# Altium schematic sheet CH32X035C-R0.SchDoc
size 304 x 254 mm
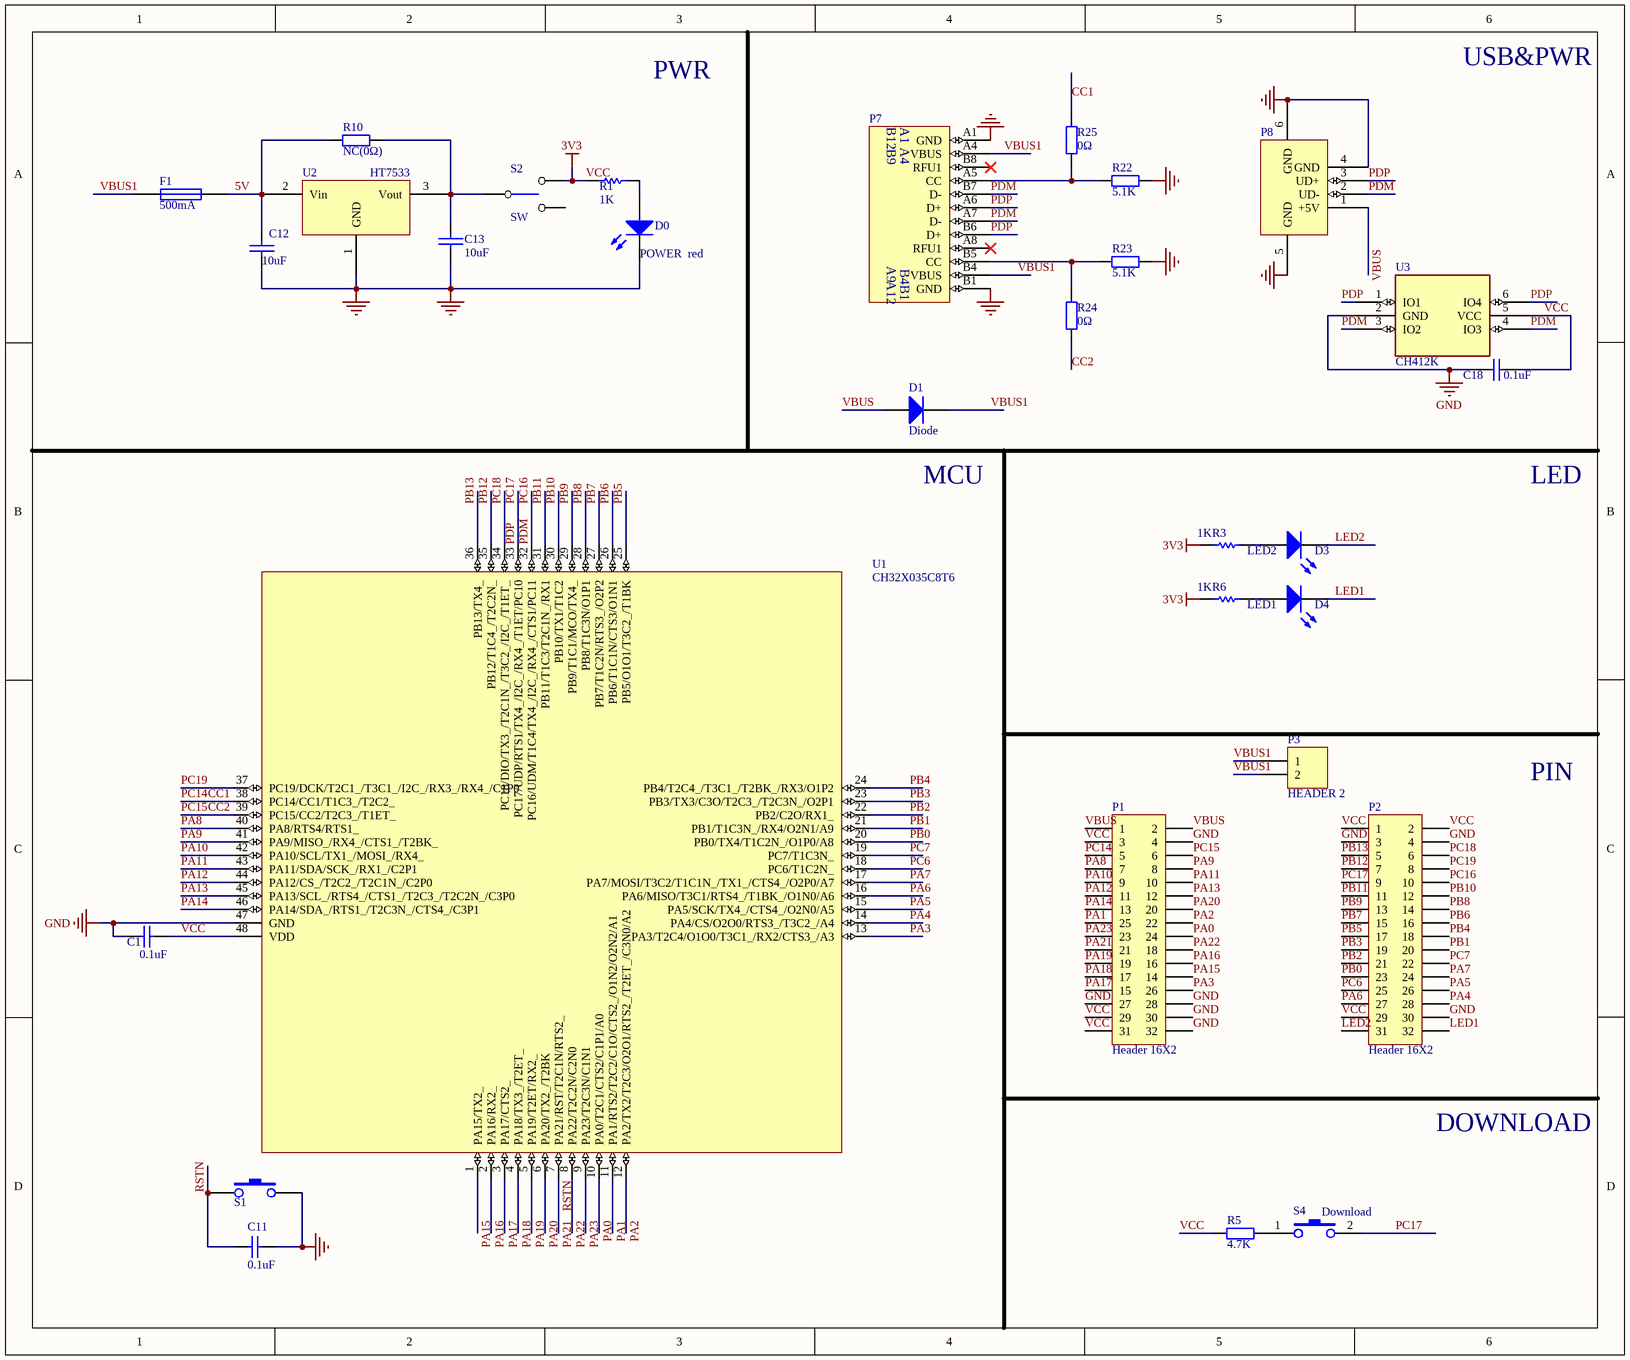
[diagram p0: CH32X035C-R0.SchDoc]

## Parts
C1  0.1uF  [0603_C]
C11  0.1uF  [0603_C]
C12  10uF  [0603_C]
C13  10uF  [0603_C]
C18  0.1uF  [0603_C]
D0  POWER  red  [0603+]
D1  Diode  [SOD-123]
D3  LED2  [0603+]
D4  LED1  [0603+]
F1  500mA  [0603]
P1  Header 16X2  [IDC32-2.54mm]
P2  Header 16X2  [IDC32-2.54mm]
P3  HEADER 2  [SIP2-2.54mm]
P7  TYPE-C  [TYPE-C-Receptacle-2.0]  (value not drawn)
P8  USB_A  [USBAF]  (value not drawn)
R1  1K  [0603]
R3  1K  [0603]
R5  4.7K  [0603]
R6  1K  [0603]
R10  NC(0Ω)  [0603]
R22  5.1K  [0603]
R23  5.1K  [0603]
R24  0Ω  [0603]
R25  0Ω  [0603]
S1  KEY  [SMD_6.1x3.65x2.5mm-KEY]  (value not drawn)
S2  SW  [SW1]
S4  Download  [SMD_6.1x3.65x2.5mm-KEY]
U1  CH32X035C8T6  [LQFP48]
U2  HT7533  [SOT-89]
U3  CH412K  [SOT-363]

## Nets
GND: C1.1 C11.1 C12.2 C13.2 C18.1 D0.2(K) P1.4 P1.27 P1.28 P1.30 P1.32 P2.3 P2.4 P2.30 P7.A1(GND) P7.B1(GND) P8.4(GND) P8.5(GND) P8.6(GND) R22.2 R23.2 S1.2 U1.47(GND) U2.1(GND) U3.2(GND)
VCC: C1.2 C18.2 P1.3 P1.29 P1.31 P2.1 P2.2 P2.29 R1.2 R3.1 R5.1 R6.1 S2.3 U1.48(VDD) U3.5(VCC)  [also labelled 3V3]
5V: C12.1 F1.2 R10.2 U2.2(Vin)
CC1: P1.5 R25.2 U1.38(PC14/CC1/T1C3_/T2C2_)  [also labelled PC14]
CC2: P1.6 R24.1 U1.39(PC15/CC2/T2C3_/T1ET_)  [also labelled PC15]
LED1: D4.2(K) P2.32
LED2: D3.2(K) P2.31
PA0: P1.24 U1.10(PA0/T2C1/CTS2/C1P1/A0)
PA1: P1.25 U1.11(PA1/RTS2/T2C2/C1O/CTS2_/O1N2/O2N2/A1)
PA2: P1.22 U1.12(PA2/TX2/T2C3/O2O1/RTS2_/T2ET_/C3N0/A2)
PA3: P1.26 U1.13(PA3/T2C4/O1O0/T3C1_/RX2/CTS3_/A3)
PA4: P2.28 U1.14(PA4/CS/O2O0/RTS3_/T3C2_/A4)
PA5: P2.26 U1.15(PA5/SCK/TX4_/CTS4_/O2N0/A5)
PA6: P2.27 U1.16(PA6/MISO/T3C1/RTS4_/T1BK_/O1N0/A6)
PA7: P2.24 U1.17(PA7/MOSI/T3C2/T1C1N_/TX1_/CTS4_/O2P0/A7)
PA8: P1.7 U1.40(PA8/RTS4/RTS1_)
PA9: P1.8 U1.41(PA9/MISO_/RX4_/CTS1_/T2BK_)
PA10: P1.9 U1.42(PA10/SCL/TX1_/MOSI_/RX4_)
PA11: P1.10 U1.43(PA11/SDA/SCK_/RX1_/C2P1)
PA12: P1.11 U1.44(PA12/CS_/T2C2_/T2C1N_/C2P0)
PA13: P1.12 U1.45(PA13/SCL_/RTS4_/CTS1_/T2C3_/T2C2N_/C3P0)
PA14: P1.13 U1.46(PA14/SDA_/RTS1_/T2C3N_/CTS4_/C3P1)
PA15: P1.14 U1.1(PA15/TX2_)
PA16: P1.16 U1.2(PA16/RX2_)
PA17: P1.15 U1.3(PA17/CTS2_)
PA18: P1.17 U1.4(PA18/TX3_/T2ET_)
PA19: P1.19 U1.5(PA19/T2ET/RX2_)
PA20: P1.20 U1.6(PA20/TX2_/T2BK)
PA21: C11.2 P1.21 S1.1 U1.7(PA21/RST/T2C1N/RTS2_)  [also labelled RSTN]
PA22: P1.18 U1.8(PA22/T2C2N/C2N0)
PA23: P1.23 U1.9(PA23/T2C3N/C1N1)
PB0: P2.23 U1.20(PB0/TX4/T1C2N_/O1P0/A8)
PB1: P2.20 U1.21(PB1/T1C3N_/RX4/O2N1/A9)
PB2: P2.21 U1.22(PB2/C2O/RX1_)
PB3: P2.19 U1.23(PB3/TX3/C3O/T2C3_/T2C3N_/O2P1)
PB4: P2.18 U1.24(PB4/T2C4_/T3C1_/T2BK_/RX3/O1P2)
PB5: P2.17 U1.25(PB5/O1O1/T3C2_/T1BK)
PB6: P2.16 U1.26(PB6/T1C1N/CTS3/O1N1)
PB7: P2.15 U1.27(PB7/T1C2N/RTS3_/O2P2)
PB8: P2.14 U1.28(PB8/T1C3N/O1P1)
PB9: P2.13 U1.29(PB9/T1C1/MCO/TX4_)
PB10: P2.12 U1.30(PB10/TX1/T1C2)
PB11: P2.11 U1.31(PB11/T1C3/T2C1N_/RX1)
PB12: P2.7 U1.35(PB12/T1C4_/T2C2N_)
PB13: P2.5 U1.36(PB13/TX4_)
PC6: P2.25 U1.18(PC6/T1C2N_)
PC7: P2.22 U1.19(PC7/T1C3N_)
PC16: P2.10 P7.A7(D-) P7.B7(D-) P8.2(UD-) U1.32(PC16/UDM/T1C4/TX4_/I2C_/RX4_/CTS1/PC11) U3.3(IO2) U3.4(IO3)  [also labelled PDM]
PC17: P2.9 P7.A6(D+) P7.B6(D+) P8.3(UD+) S4.2 U1.33(PC17/UDP/RTS1/TX4_/I2C_/RX4_/T1ET/PC10) U3.1(IO1) U3.6(IO4)  [also labelled PDP]
PC18: P2.6 U1.34(PC18/DIO/TX3_/T2C1N_/T3C2_/I2C_/T1ET_)
PC19: P2.8 U1.37(PC19/DCK/T2C1_/T3C1_/I2C_/RX3_/RX4_/C1P0)
VBUS: D1.1(A) P1.1 P1.2 P8.1(+5V)
VBUS1: D1.2(K) F1.1 P3.1 P3.2 P7.A4(VBUS) P7.B4(VBUS)
NetC13_1: C13.1 R10.1 S2.1 U2.3(Vout)
NetD0_1: D0.1(A) R1.1
NetD3_1: D3.1(A) R3.2
NetD4_1: D4.1(A) R6.2
NetP7_A5: P7.A5(CC) R22.1 R25.1
NetP7_B5: P7.B5(CC) R23.1 R24.2
NetR5_2: R5.2 S4.1

Not connected (* = marked no-connect by the designer): P7 A8(RFU1)* B8(RFU1)*; S2 2

## Notes on the sheet
- PWR
- USB&PWR
- (near D1) MCU
- LED
- PIN
- DOWNLOAD
- (in symbol TYPE-C1) B12; B9; A9; A12

## Library data of the parts
C1 C11 C18 = Cap: Capacitor
C12 C13 = CAP: Capacitor
D0 D3 D4 = LED0: Typical INFRARED GaAs LED; Published: 8-Jun-2000; LatestRevisionDate: 08-Jul-2005; LatestRevisionNote: Mech Layer 1 removed.; PackageReference: LED-0; Publisher: Altium Limited
D1 = Diode: Default Diode; Published: 8-Jun-2000; LatestRevisionDate: 17-Jul-2002; LatestRevisionNote: Re-released for DXP Platform.; PackageVersion: Sep-1996; PackageReference: SMC; Publisher: Altium Limited; Code_JEDEC: DO-214-AB
F1 = FUSE1: Fuse
P1 P2 = Header 16X2: Header, 16-Pin, Dual row; LatestRevisionDate: 17-Jul-2002; LatestRevisionNote: Re-released for DXP Platform.; Publisher: Altium Limited
P3 = HEADER 2: Header, 2-Pin
P7 = TYPE-C1
P8 = USB: USB Port
R1 R3 R6 = Res Semi: Semiconductor Resistor
R5 R10 R22-R25 = Res2: Resistor
S4 = KEY1
U1 = CH32X035C8T6: RISC-V MCU with USB/PD/ADC/SPI/I2C/UART/OA/CMP
U2 = 1117-3.3V
U3 = CH412K: Qaud ESD protect, high speed